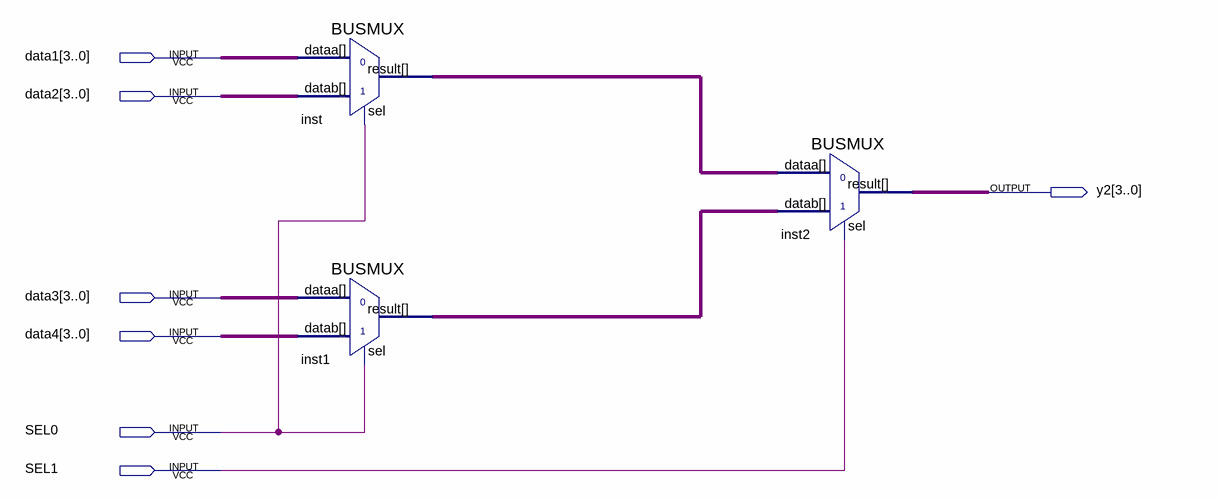
[diagram p0: schematic sheet]
// Quartus schematic 5_multiplex_4bits.bdf as structural Verilog: 3 symbols, 7 pins
module \5_multiplex_4bits  (
  input  [3:0] data1,
  input  [3:0] data2,
  input  [3:0] data3,
  input  [3:0] data4,
  input  SEL0,
  input  SEL1,
  output [3:0] y2
);

  wire inst1_result, inst_result;

  BUSMUX inst (.datab(data2), .sel(SEL0), .dataa(data1), .result(inst_result));
  BUSMUX inst1 (.datab(data4), .sel(SEL0), .dataa(data3), .result(inst1_result));
  BUSMUX inst2 (.datab(inst1_result), .sel(SEL1), .dataa(inst_result), .result(y2));
endmodule
